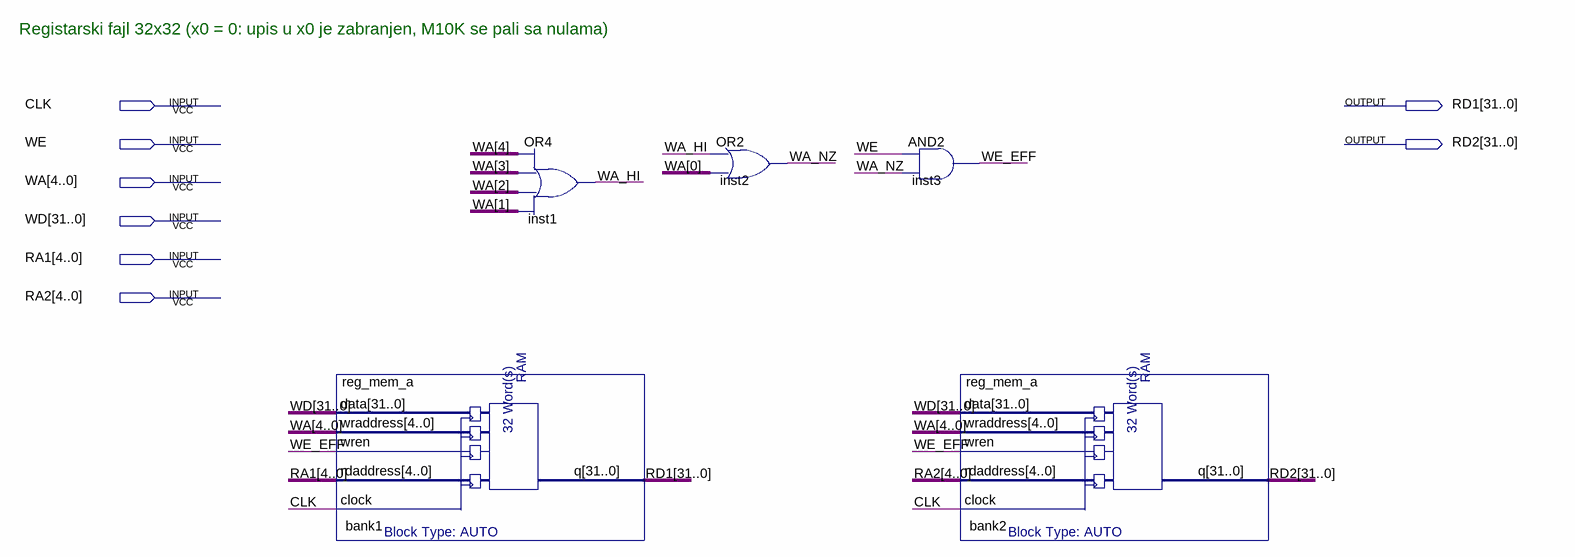
[diagram p0: schematic sheet]
// Quartus schematic register_file.bdf as structural Verilog: 5 symbols, 8 pins
module register_file (
  input  CLK,
  input  WE,
  input  [4:0] WA,
  input  [31:0] WD,
  input  [4:0] RA1,
  input  [4:0] RA2,
  output [31:0] RD1,
  output [31:0] RD2
);

  wire WA_HI, WA_NZ, WE_EFF;

  reg_mem_a bank1 (.data(WD), .wraddress(WA), .wren(WE_EFF), .rdaddress(RA1), .clock(CLK), .q(RD1));
  or inst1 (WA_HI, WA[4], WA[3], WA[2], WA[1]);
  or inst2 (WA_NZ, WA_HI, WA[0]);
  and inst3 (WE_EFF, WE, WA_NZ);
  reg_mem_a bank2 (.data(WD), .wraddress(WA), .wren(WE_EFF), .rdaddress(RA2), .clock(CLK), .q(RD2));

  // Notes on the sheet:
  //   Registarski fajl 32x32 (x0 = 0: upis u x0 je zabranjen, M10K se pali sa nulama)
endmodule
